# Altium schematic sheet telem.SchDoc: Board Telemetry
size Letter; CheckedBy: J. Brinton; CompanyName: Signal Laboratories, Inc.; DrawnBy: J. Brinton; Engineer: J. Brinton; Address1: 3479 Edison Way; Address2: Menlo Park CA 94025; Address3: +1 (877) 778-8435; Address4: siglabs.com; Revision: 1; SheetNumber: 37; SheetTotal: 49
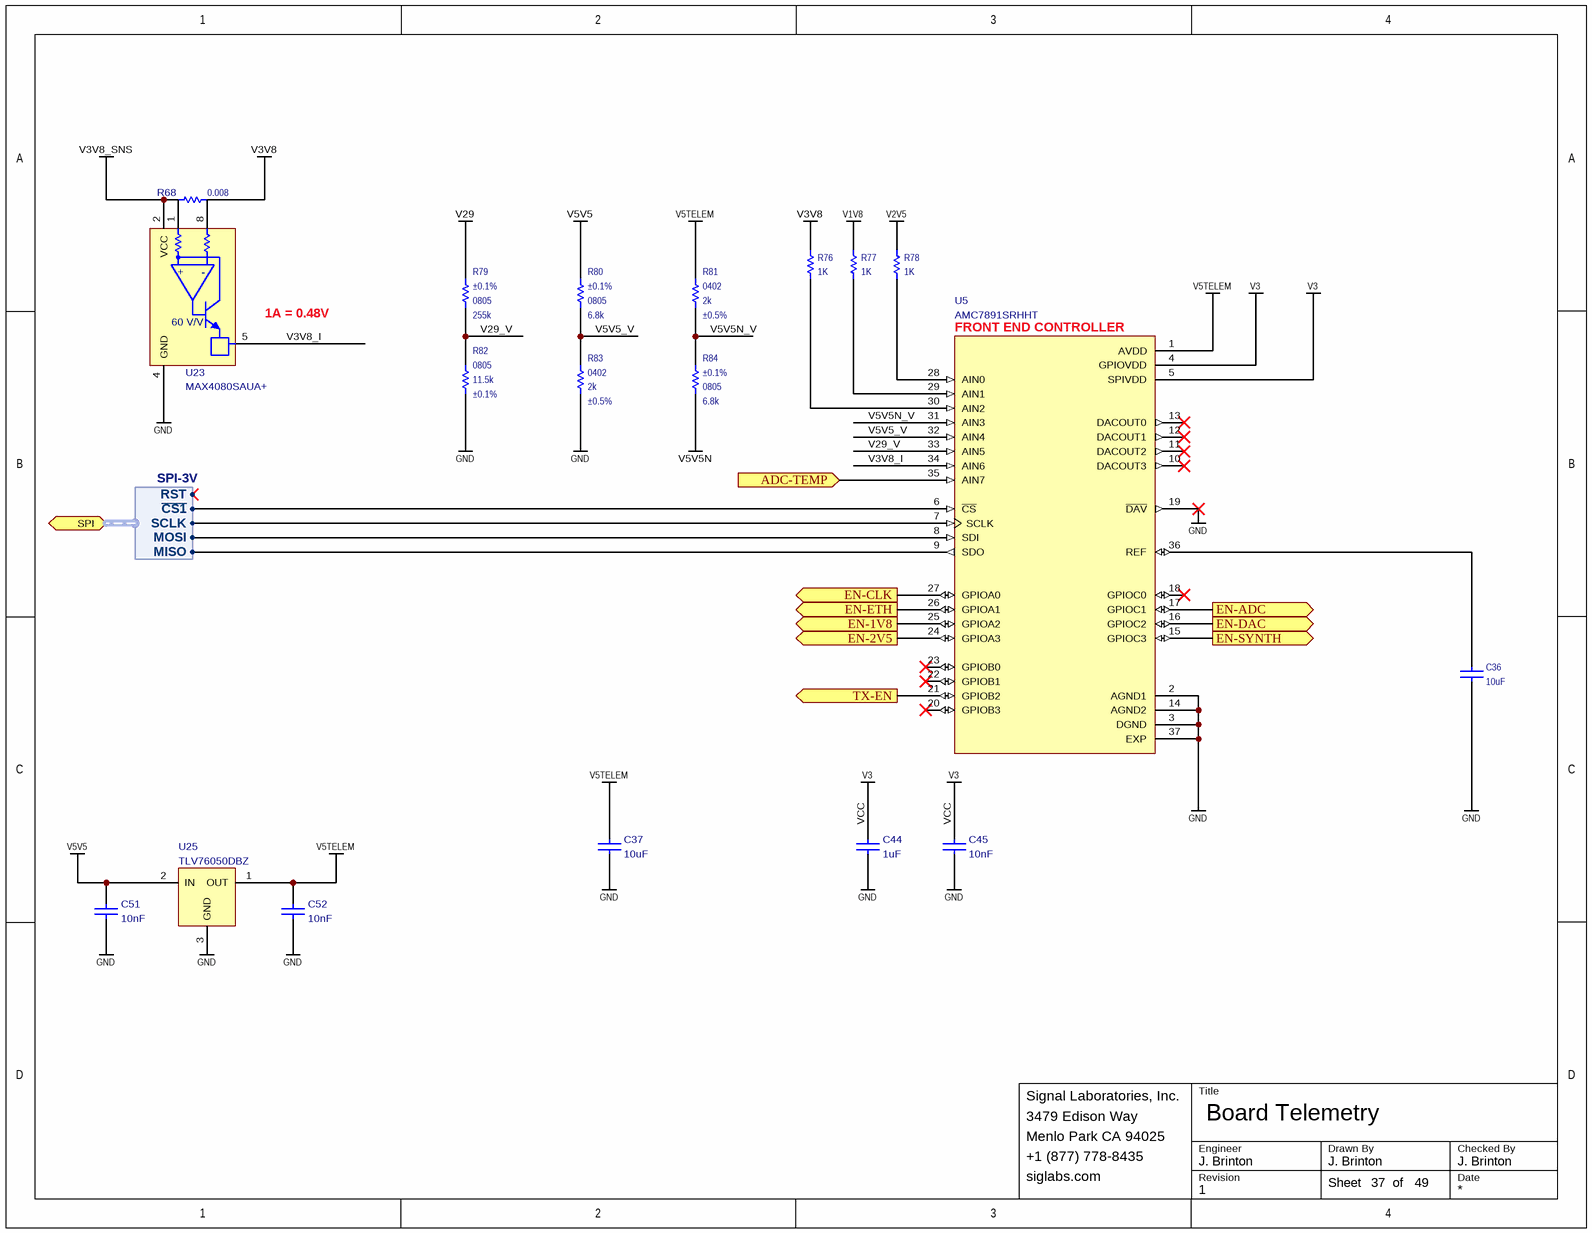
[diagram p0: telem.SchDoc]

## Parts
C36  value 10uF  [CAPC160X80X90L20N]  (hidden comment: ZRB18AR61E106ME01L)
C37  value 10uF  [CAPC200X125X145L45N]  (hidden comment: CL21B106KOQNNNE)
C44  value 1uF  [CAPC200X125X145L45N]  (hidden comment: TMK212B7105KG)
C45  value 10nF  [CAPC100X50X55L25N]  (hidden comment: GRM155R71H103KA88)
C51  value 10nF  [CAPC100X50X55L25N]  (hidden comment: GRM155R71H103KA88)
C52  value 10nF  [CAPC100X50X55L25N]  (hidden comment: GRM155R71H103KA88)
R68  value 0.008  [KRL3216T4]  (hidden comment: KRL3216T4A-M-R008-F-T1)
R76  value 1K  [RESC1005X40N]  (hidden comment: RC0402FR-071KL)
R77  value 1K  [RESC1005X40N]  (hidden comment: RC0402FR-071KL)
R78  value 1K  [RESC1005X40N]  (hidden comment: RC0402FR-071KL)
R79  value 255k  Tolerance: ±0.1%  Package: 0805  [RESC2012X70N]  (hidden comment: PTN0805E2553BST1)
R80  value 6.8k  Tolerance: ±0.1%  Package: 0805  [RESC2012X70N]  (hidden comment: RG2012P-682-B-T5)
R81  value 2k  Tolerance: ±0.5%  Package: 0402  [RESC1005X40N]  (hidden comment: RR0510P-202-D)
R82  value 11.5k  Tolerance: ±0.1%  Package: 0805  [RESC2012X70N]  (hidden comment: RT0805BRD0711K5L)
R83  value 2k  Tolerance: ±0.5%  Package: 0402  [RESC1005X40N]  (hidden comment: RR0510P-202-D)
R84  value 6.8k  Tolerance: ±0.1%  Package: 0805  [RESC2012X70N]  (hidden comment: RG2012P-682-B-T5)
U5  AMC7891SRHHT  [QFN50P600X600X90-37N]
U23  MAX4080SAUA+  [uMAX8]
U25  TLV76050DBZ  [SOT23]

## Ports
ADC-TEMP (in), EN-1V8 (out), EN-2V5 (out), EN-ADC (out), EN-CLK (out), EN-DAC (out), EN-ETH (out), EN-SYNTH (out), SPI (harness SPI-3V), TX-EN (out)

## Harnesses
SPI-3V: MOSI, MISO, SCLK, ~{CS1}, RST

## Nets
GND: C36.1 C37.2 C44.2 C45.2 C51.2 C52.2 R82.1 R83.1 U5.2(AGND1) U5.3(DGND) U5.14(AGND2) U5.19(~{DAV}) U5.37(EXP) U23.4(GND) U25.3(GND)
V1V8: R77.2
V2V5: R78.2
V3V8: R68.1 R76.2
V3V8_SNS: R68.2 U23.2(VCC)
V5TELEM: C37.1 C52.1 R81.2 U5.1(AVDD) U25.1(OUT)
V5V5: C51.1 R80.1 U25.2(IN)
V5V5N: R84.2
V29: R79.1
VCC: C44.1 C45.1 U5.4(GPIOVDD) U5.5(SPIVDD)  [also labelled V3]
ADC-TEMP: U5.35(AIN7) ; port ADC-TEMP
EN-1V8: U5.25(GPIOA2) ; port EN-1V8
EN-2V5: U5.24(GPIOA3) ; port EN-2V5
EN-ADC: U5.17(GPIOC1) ; port EN-ADC
EN-CLK: U5.27(GPIOA0) ; port EN-CLK
EN-DAC: U5.16(GPIOC2) ; port EN-DAC
EN-ETH: U5.26(GPIOA1) ; port EN-ETH
EN-SYNTH: U5.15(GPIOC3) ; port EN-SYNTH
TX-EN: U5.21(GPIOB2) ; port TX-EN
V3V8_I: U5.34(AIN6) U23.5(OUT)
V5V5_V: R80.2 R83.2 U5.32(AIN4)
V5V5N_V: R81.1 R84.1 U5.31(AIN3)
V29_V: R79.2 R82.2 U5.33(AIN5)
NetC36_2: C36.2 U5.36(REF)
NetR68_3: R68.3 U23.8(RS-)
NetR68_4: R68.4 U23.1(RS+)
NetR76_1: R76.1 U5.30(AIN2)
NetR77_1: R77.1 U5.29(AIN1)
NetR78_1: R78.1 U5.28(AIN0)
NetU5_6: U5.6(~{CS}) ; port SPI.~{CS1}
NetU5_7: U5.7(SCLK) ; port SPI.SCLK
NetU5_8: U5.8(SDI) ; port SPI.MOSI
NetU5_9: U5.9(SDO) ; port SPI.MISO

Not connected (* = marked no-connect by the designer): U5 10(DACOUT3)* 11(DACOUT2)* 12(DACOUT1)* 13(DACOUT0)* 18(GPIOC0)* 20(GPIOB3)* 22(GPIOB1)* 23(GPIOB0)*

## Notes on the sheet
- (near U23) 1A = 0.48V
- (near U5) FRONT END CONTROLLER
- Title
- Engineer
- Revision
- Drawn By
- Checked By
- Date
- Sheet
- of
- (in symbol MAX4080SAUA+) +; -; 60 V/V

## Library data of the parts
C36 = CAP: Ceramic Capacitor 10uF ±20% 25V X5R 0603; Manufacturer: Murata; Tr: -55:85; Manufacturer P/N: ZRB18AR61E106ME01L; Tolerance: ±20%; Voltage: 25V; Footprint: *; Package: 0603
C37 = LMK212B7106KG: Ceramic Capacitor 10uF ±10% 16V X7R 0805; Manufacturer: Samsung; Tr: -55:105; Manufacturer P/N: CL21B106KOQNNNE; Tolerance: ±10%; Package: 0805; Voltage: 16V
C44 = TMK212B7105KG: Ceramic Capacitor 1uF ±10% 25V X7R 0805; Manufacturer: Taiyo Yuden; Manufacturer P/N: TMK212B7105KG; Tolerance: ±10%; Tr: *; Package: 0805; Voltage: 25V
C45 C51 C52 = TMK105B7103KV: Ceramic Capacitor 10nF ±10% 50V X7R 0402; Manufacturer: Murata; Tr: -55:125; Manufacturer P/N: GRM155R71H103KA88; Tolerance: ±10%; Package: 0402; Voltage: 50V
R68 = KRL3216T4A-M-R009-F: Current Sense Resistor 8 mOhms +/-1% SMD 4-Terminal; Manufacturer: Susumu; Tolerance: ±1%; Tr: -55:+155; Manufacturer P/N: KRL3216T4A-M-R008-F-T1
R76-R78 = RES 0402: Thick Film Resistor 1k ±1% 0402; Manufacturer: Yageo; Tr: -55:155; Package: 0402; Manufacturer P/N: RC0402FR-071KL; Do Not Place: *; Tolerance: ±1%
R79 = RES: Thin Film Resistor 255k +/-0.1% SMD 0805; Manufacturer: Vishay; Tr: -55:155; Tcr: *; Manufacturer P/N: PTN0805E2553BST1; Alternatives: *; Voltage: *; Power: *
R80 R84 = RES: Thin Film Resistor 6.8k +/-0.1% SMD 0805; Manufacturer: Susumu; Tr: -55:155; Tcr: *; Manufacturer P/N: RG2012P-682-B-T5; Alternatives: *; Voltage: *; Power: *
R81 R83 = RES: Thin Film Resistor 2k +/-0.5% SMD 0402; Manufacturer: Susumu; Tr: -55:155; Tcr: *; Manufacturer P/N: RR0510P-202-D; Alternatives: *; Voltage: *; Power: *
R82 = RES: Thin Film Resistor 11.5k +/-0.1% SMD 0805; Manufacturer: Yageo; Tr: -55:155; Tcr: *; Manufacturer P/N: RT0805BRD0711K5L; Alternatives: *; Voltage: *; Power: *
U5 = AMC7891SRHHT: Analog Monitoring & Control IC; Manufacturer: Texas Instruments; Manufacturer P/N: AMC7891SRHHT; Package: VQFN-36
U23 = MAX4080SAUA+: High-Side Current-Sense Amplifier; Manufacturer: Maxim; Manufacturer P/N: MAX4080SAUA+
U25 = TLV76033DBZ: 3.3V Fixed-Output LDO; Manufacturer: Texas Instruments; Manufacturer P/N: TLV76033DBZ